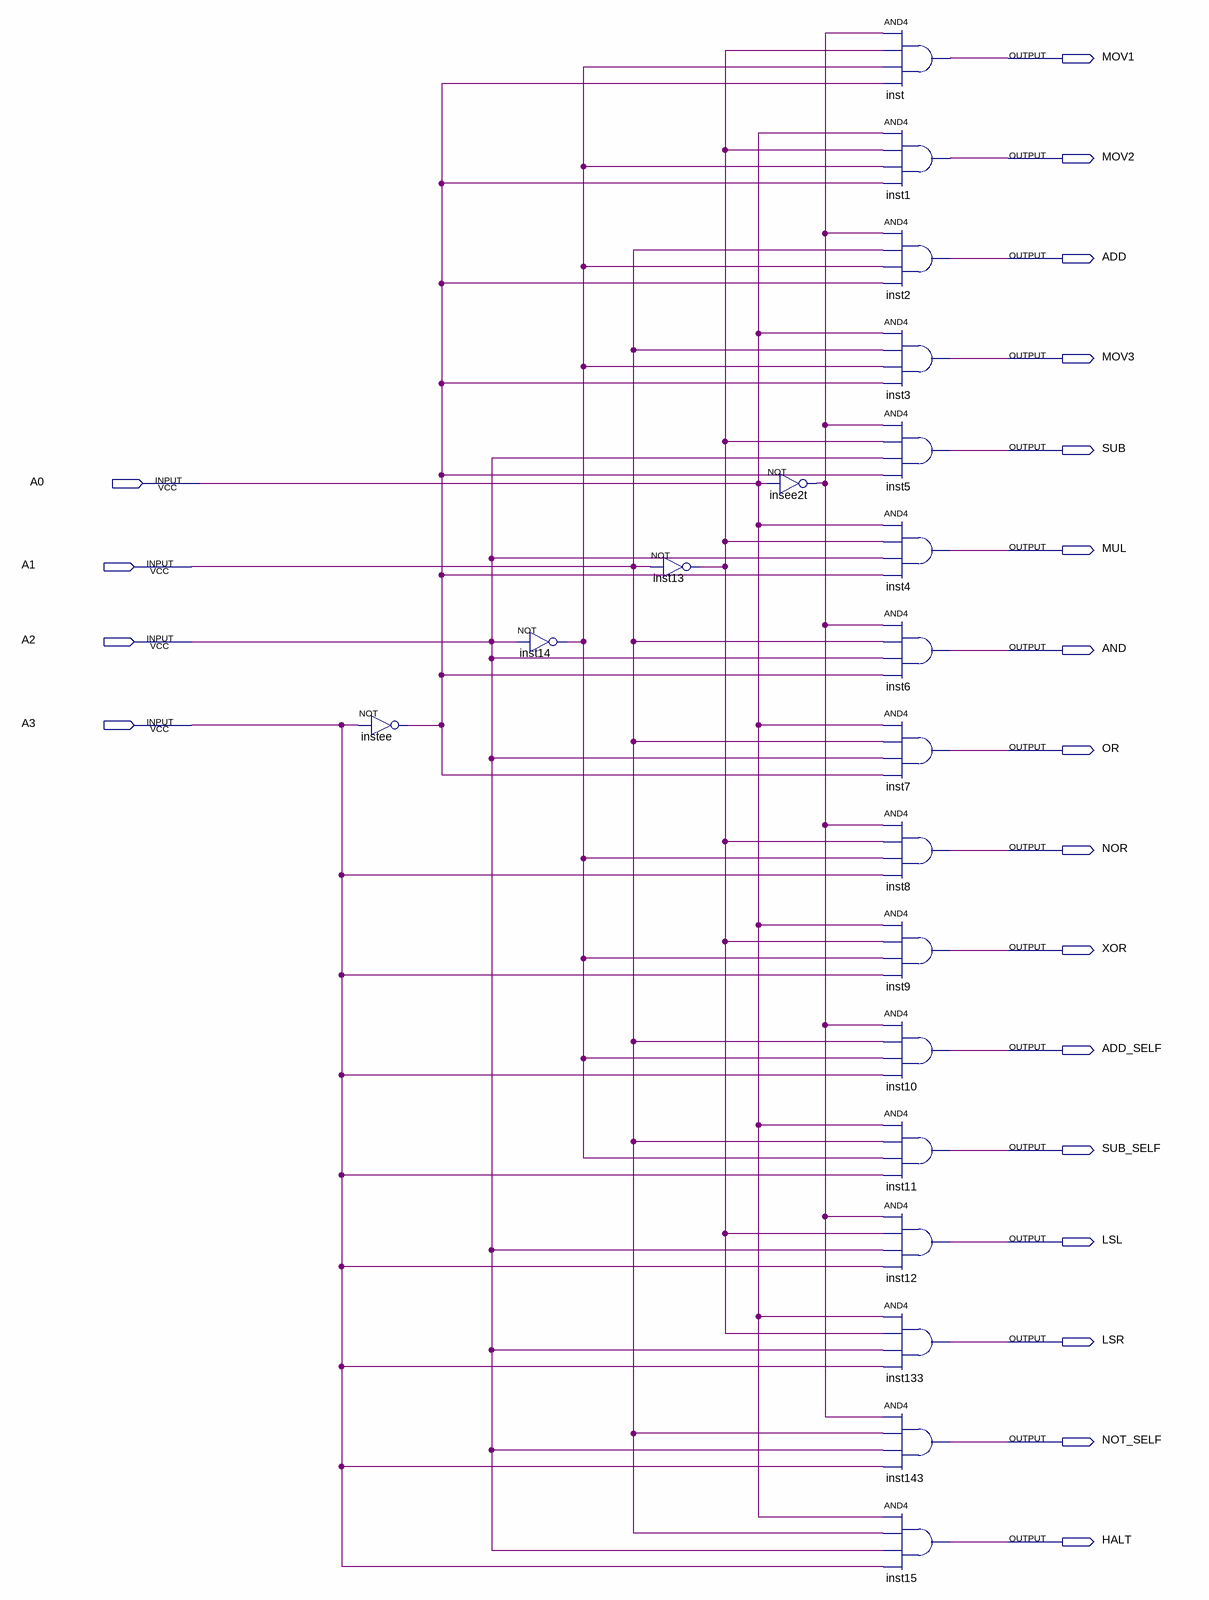
[diagram p0: schematic sheet]
// Quartus schematic 4_16decoder.bdf as structural Verilog: 20 symbols, 20 pins
module \4_16decoder  (
  input  A0,
  input  A1,
  input  A2,
  input  A3,
  output MOV1,
  output MOV2,
  output ADD,
  output MOV3,
  output SUB,
  output MUL,
  output AND,
  output OR,
  output NOR,
  output XOR,
  output ADD_SELF,
  output SUB_SELF,
  output LSL,
  output LSR,
  output NOT_SELF,
  output HALT
);

  wire insee2t_out, inst13_out, inst14_out, instee_out;

  not instee (instee_out, A3);
  not inst14 (inst14_out, A2);
  not inst13 (inst13_out, A1);
  not insee2t (insee2t_out, A0);
  and inst (MOV1, insee2t_out, inst13_out, inst14_out, instee_out);
  and inst1 (MOV2, A0, inst13_out, inst14_out, instee_out);
  and inst2 (ADD, insee2t_out, A1, inst14_out, instee_out);
  and inst3 (MOV3, A0, A1, inst14_out, instee_out);
  and inst5 (SUB, insee2t_out, inst13_out, A2, instee_out);
  and inst4 (MUL, A0, inst13_out, A2, instee_out);
  and inst6 (AND, insee2t_out, A1, A2, instee_out);
  and inst7 (OR, A0, A1, A2, instee_out);
  and inst8 (NOR, insee2t_out, inst13_out, inst14_out, A3);
  and inst9 (XOR, A0, inst13_out, inst14_out, A3);
  and inst10 (ADD_SELF, insee2t_out, A1, inst14_out, A3);
  and inst11 (SUB_SELF, A0, A1, inst14_out, A3);
  and inst12 (LSL, insee2t_out, inst13_out, A2, A3);
  and inst133 (LSR, A0, inst13_out, A2, A3);
  and inst143 (NOT_SELF, insee2t_out, A1, A2, A3);
  and inst15 (HALT, A0, A1, A2, A3);
endmodule
